# EAGLE design Smart ezNODE 503 M1 (EAGLE 7.7.0)
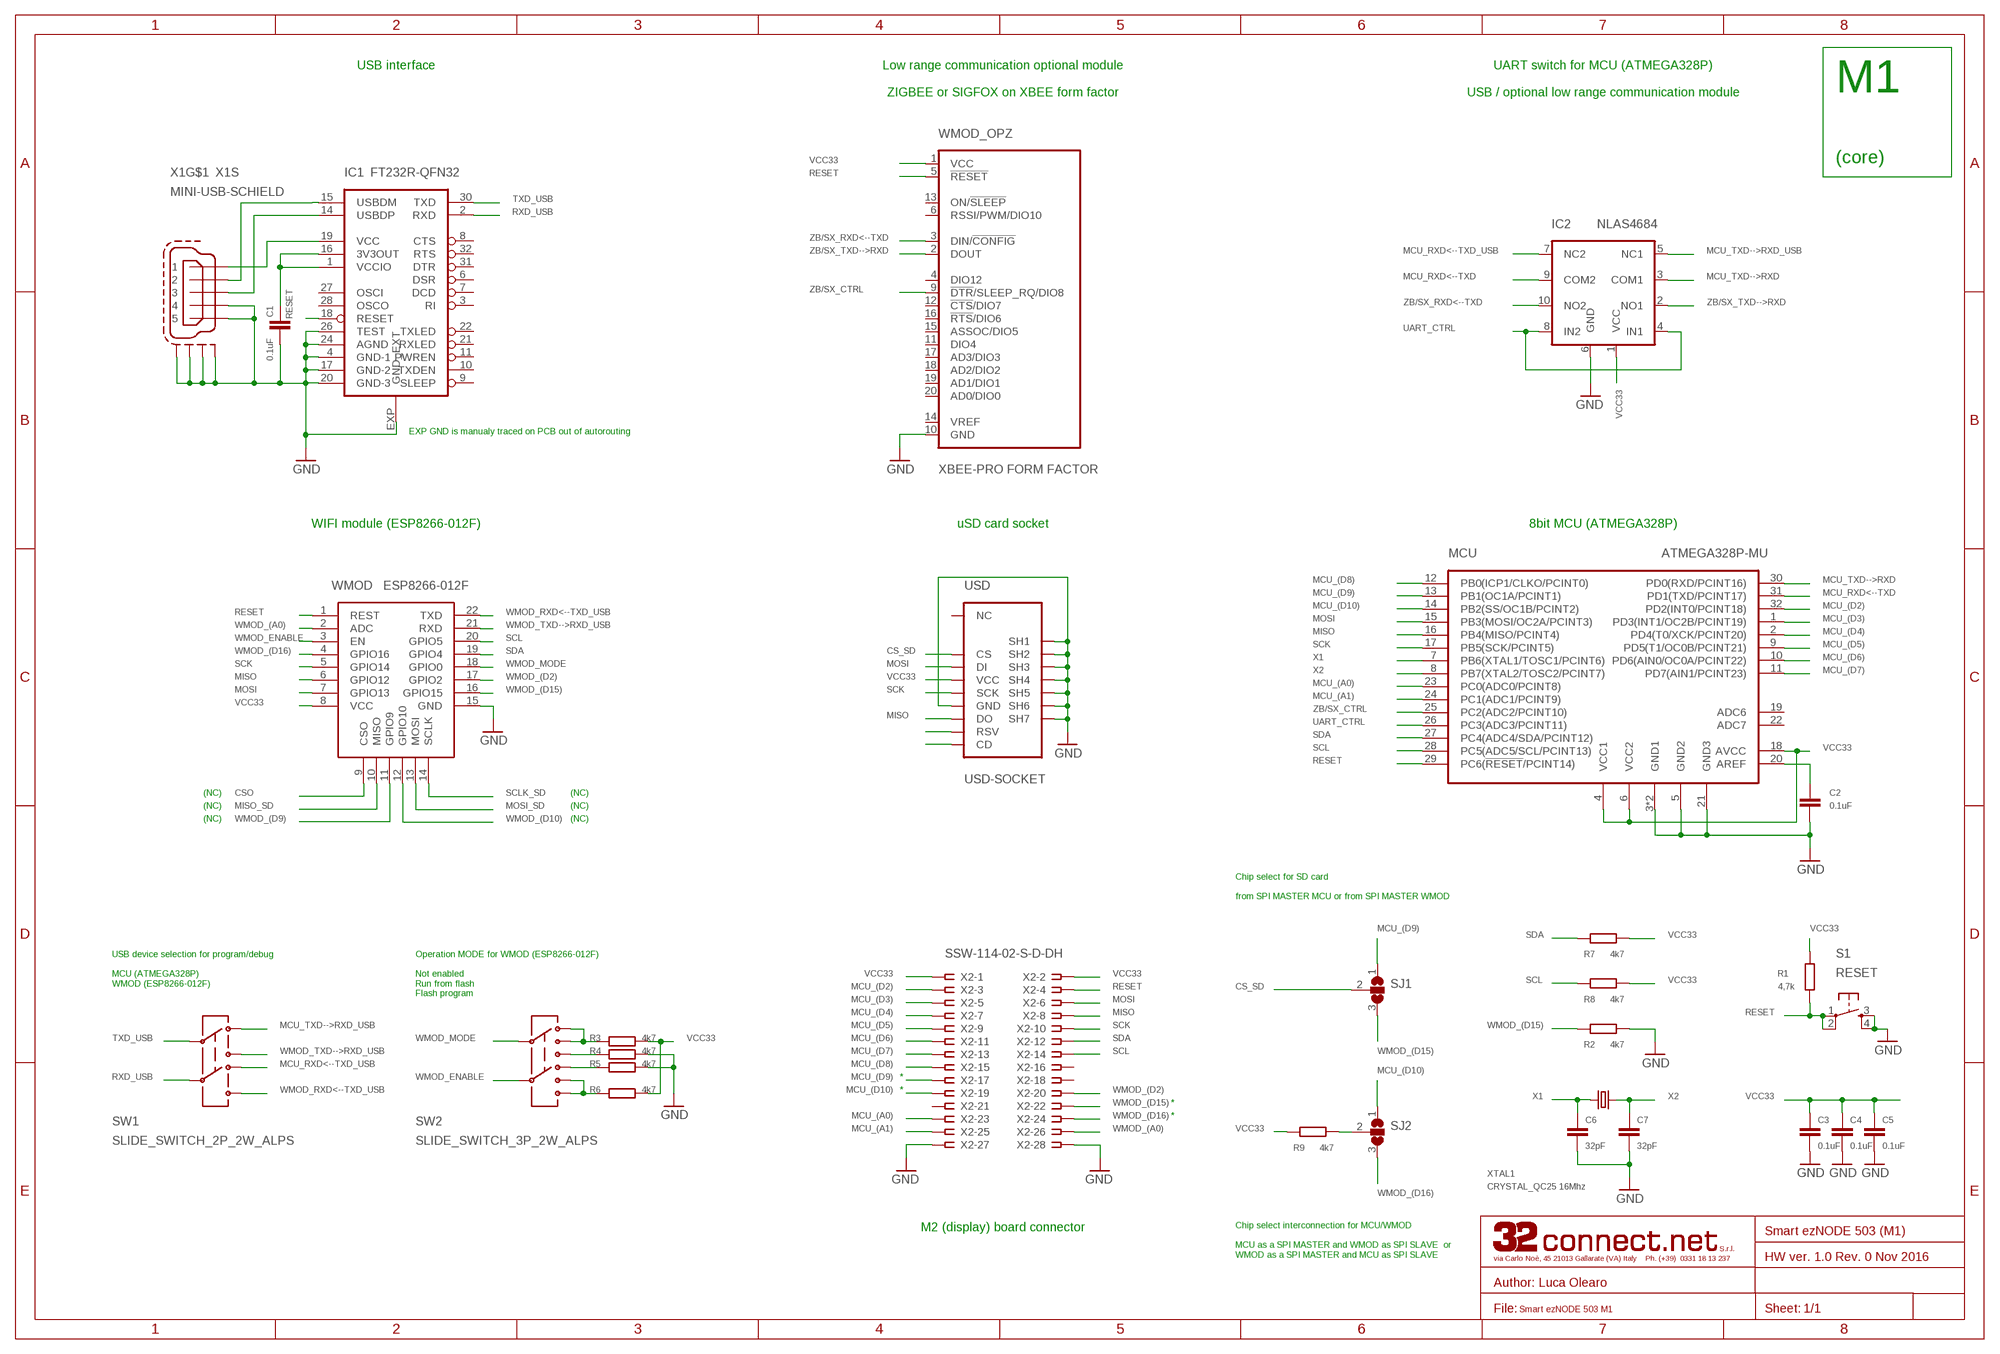
[diagram p0: schematic, sheet 1]

## Parts
C1  0.1uF  C-EUC0402  [C0402]
C2  0.1uF  C-EUC0402  [C0402]
C3  0.1uF  C-EUC0402  [C0402]
C4  0.1uF  C-EUC0402  [C0402]
C5  0.1uF  C-EUC0402  [C0402]
C6  32pF  C-EUC0201  [C0201]
C7  32pF  C-EUC0201  [C0201]
IC1  FT232R-QFN32  [QFN32]
IC2  NLAS4684  NLAS4684MSOP10  [MSOP10]
MCU  ATMEGA328P-MU  ATMEGA48/88/168/328_REDUCED-MU  [MLF32]
R1  4,7k  R-EU_R0402  [R0402]
R2  4k7  R-EU_R0402  [R0402]
R3  4k7  R-EU_R0402  [R0402]
R4  4k7  R-EU_R0402  [R0402]
R5  4k7  R-EU_R0402  [R0402]
R6  4k7  R-EU_R0402  [R0402]
R7  4k7  R-EU_R0402  [R0402]
R8  4k7  R-EU_R0402  [R0402]
R9  4k7  R-EU_R0402  [R0402]
S1  RESET  TAC_SWITCH4  [C&K_KMS]
SJ1  SJ2W  [SJ_2]
SJ2  SJ2W  [SJ_2]
SW1  SLIDE_SWITCH_2P_2W_ALPS  SLIDE_SWITCH_2P_2W_ALPS_SSSS820201  [SLIDE_SWITCH_ALPS_SSSS820201]
SW2  SLIDE_SWITCH_3P_2W_ALPS  SLIDE_SWITCH_3P_2W_ALPS_SSSS820301  [SLIDE_SWITCH_ALPS_SSSS820301]
USD  USD-SOCKET  [USD-SOCKET-PP]
WMOD  ESP8266-012F  ESP8266-12GPIO04/05_CORRECTED  [ESP8266-ESP12]
WMOD_OPZ  XBEE-PRO FORM FACTOR  XBEE-PRO  [XBEE-PRO]
X1  MINI-USB-SCHIELD  MINI-USB-SCHIELD--  [MOLEX_67503-X20]
X2  SSW-114-02-S-D-DH  [FTE-114-XX-G-DH]
XTAL1  CRYSTAL_QC25 16Mhz  CRYSTAL_QC25  [CRYSTAL_QC25]

## Nets
CS_SD: SJ1.2 USD.P$2(CS)
CSO: WMOD.9(CSO)
D+: IC1.14(USBDP) X1.3
D-: IC1.15(USBDM) X1.2
GND: C1.2 C2.2 C3.2 C4.2 C5.2 C6.2 C7.2 IC1.4(GND-1) IC1.17(GND-2) IC1.20(GND-3) IC1.24(AGND) IC1.26(TEST) IC1.EXP(GND_EXT) IC2.6(GND) MCU.3(GND1) MCU.5(GND2) MCU.21(GND3) MCU.TH(GND1) R2.2 R4.1 R5.1 S1.3 S1.4 USD.P$6(GND) USD.P$9(SH1) USD.P$10(SH2) USD.P$12(SH3) USD.P$13(SH4) USD.P$14(SH5) USD.P$15(SH6) USD.P$16(SH7) WMOD.15(GND) WMOD_OPZ.10(GND) X1.4 X1.5 X1.M1(S:S1) X1.M2(S:S2) X1.M3(S:S3) X1.M4(S:S4) X2.27 X2.28
MCU_(A0): MCU.23(PC0(ADC0/PCINT8)) X2.23
MCU_(A1): MCU.24(PC1(ADC1/PCINT9)) X2.25
MCU_(D2): MCU.32(PD2(INT0/PCINT18)) X2.3
MCU_(D3): MCU.1(PD3(INT1/OC2B/PCINT19)) X2.5
MCU_(D4): MCU.2(PD4(T0/XCK/PCINT20)) X2.7
MCU_(D5): MCU.9(PD5(T1/OC0B/PCINT21)) X2.9
MCU_(D6): MCU.10(PD6(AIN0/OC0A/PCINT22)) X2.11
MCU_(D7): MCU.11(PD7(AIN1/PCINT23)) X2.13
MCU_(D8): MCU.12(PB0(ICP1/CLKO/PCINT0)) X2.15
MCU_(D9): MCU.13(PB1(OC1A/PCINT1)) SJ1.1 X2.17
MCU_(D10): MCU.14(PB2(SS/OC1B/PCINT2)) SJ2.1 X2.19
MCU_RXD<--TXD: IC2.9(COM2) MCU.31(PD1(TXD/PCINT17))
MCU_RXD<--TXD_USB: IC2.7(NC2) SW1.4
MCU_TXD-->RXD: IC2.3(COM1) MCU.30(PD0(RXD/PCINT16))
MCU_TXD-->RXD_USB: IC2.5(NC1) SW1.1
MISO: MCU.16(PB4(MISO/PCINT4)) USD.P$7(DO) WMOD.6(GPIO12) X2.8
MISO_SD: WMOD.10(MISO)
MOSI: MCU.15(PB3(MOSI/OC2A/PCINT3)) USD.P$3(DI) WMOD.7(GPIO13) X2.6
MOSI_SD: WMOD.13(MOSI)
N$1: R9.2 SJ2.2
N$6: C1.1 IC1.1(VCCIO) IC1.16(3V3OUT)
N$9: R6.2 SW2.6 SW2.8
N$11: C2.1 MCU.20(AREF)
N$12: R3.2 SW2.1 SW2.2
N$14: R4.2 SW2.4
N$15: R5.2 SW2.5
N$18: USD.P$8(RSV)
N$19: USD.P$11(CD)
RESET: IC1.18(RESET) MCU.29(PC6(!RESET!/PCINT14)) R1.1 S1.1 S1.2 WMOD.1(REST) WMOD_OPZ.5(!RESET) X2.4
RXD_USB: IC1.2(RXD) SW1.5
SCK: MCU.17(PB5(SCK/PCINT5)) USD.P$5(SCK) WMOD.5(GPIO14) X2.10
SCL: MCU.28(PC5(ADC5/SCL/PCINT13)) R8.1 WMOD.20(GPIO5) X2.14
SCLK_SD: WMOD.14(SCLK)
SDA: MCU.27(PC4(ADC4/SDA/PCINT12)) R7.1 WMOD.19(GPIO4) X2.12
TXD_USB: IC1.30(TXD) SW1.2
UART_CTRL: IC2.4(IN1) IC2.8(IN2) MCU.26(PC3(ADC3/PCINT11))
VBUS: IC1.19(VCC) X1.1
VCC33 [VCC1]: C3.1 C4.1 C5.1 IC2.1(VCC) MCU.4(VCC1) MCU.6(VCC2) MCU.18(AVCC) R1.2 R3.1 R6.1 R7.2 R8.2 R9.1 USD.P$4(VCC) WMOD.8(VCC) WMOD_OPZ.1(VCC) X2.1 X2.2
WMOD_(A0): WMOD.2(ADC) X2.26
WMOD_(D2): WMOD.17(GPIO2) X2.20
WMOD_(D9): WMOD.11(GPIO9)
WMOD_(D10): WMOD.12(GPIO10)
WMOD_(D15): R2.1 SJ1.3 WMOD.16(GPIO15) X2.22
WMOD_(D16): SJ2.3 WMOD.4(GPIO16) X2.24
WMOD_ENABLE: SW2.7 WMOD.3(EN)
WMOD_MODE: SW2.3 WMOD.18(GPIO0)
WMOD_RXD<--TXD_USB: SW1.6 WMOD.22(TXD)
WMOD_TXD-->RXD_USB: SW1.3 WMOD.21(RXD)
X1: C6.1 MCU.7(PB6(XTAL1/TOSC1/PCINT6)) XTAL1.P$1
X2: C7.1 MCU.8(PB7(XTAL2/TOSC2/PCINT7)) XTAL1.P$3
ZB/SX_CTRL: MCU.25(PC2(ADC2/PCINT10)) WMOD_OPZ.9(!DTR!/SLEEP_RQ/DIO8)
ZB/SX_RXD<--TXD: IC2.10(NO2) WMOD_OPZ.3(DIN/!CONFIG)
ZB/SX_TXD-->RXD: IC2.2(NO1) WMOD_OPZ.2(DOUT)
Unconnected: IC1.3(RI) IC1.6(DSR) IC1.7(DCD) IC1.8(CTS) IC1.9(SLEEP) IC1.10(TXDEN) IC1.11(PWREN) IC1.21(RXLED) IC1.22(TXLED) IC1.27(OSCI) IC1.28(OSCO) IC1.31(DTR) IC1.32(RTS) MCU.19(ADC6) MCU.22(ADC7) USD.P$1(NC) WMOD_OPZ.4(DIO12) WMOD_OPZ.6(RSSI/PWM/DIO10) WMOD_OPZ.11(DIO4) WMOD_OPZ.12(!CTS!/DIO7) WMOD_OPZ.13(ON/!SLEEP) WMOD_OPZ.14(VREF) WMOD_OPZ.15(ASSOC/DIO5) WMOD_OPZ.16(!RTS!/DIO6) WMOD_OPZ.17(AD3/DIO3) WMOD_OPZ.18(AD2/DIO2) WMOD_OPZ.19(AD1/DIO1) WMOD_OPZ.20(AD0/DIO0) X2.16 X2.18 X2.21 XTAL1.P$2 XTAL1.P$4

## Notes on the sheet
- USB interface
- Low range communication optional module
  
  ZIGBEE or SIGFOX on XBEE form factor
- UART switch for MCU (ATMEGA328P)
  
  USB / optional low range communication module
- M1
- (core)
- EXP GND is manualy traced on PCB out of autorouting
- WIFI module (ESP8266-012F) | uSD card socket | 8bit MCU (ATMEGA328P)
- (NC) | (NC)
- (NC) | (NC)
- (NC) | (NC)
- Chip select for SD card
  
  from SPI MASTER MCU or from SPI MASTER WMOD
- USB device selection for program/debug
  
  MCU (ATMEGA328P)
  WMOD (ESP8266-012F)
- Operation MODE for WMOD (ESP8266-012F)
  
  Not enabled
  Run from flash
  Flash program
- *
- *
- *
- *
- M2 (display) board connector
- Chip select interconnection for MCU/WMOD
  
  MCU as a SPI MASTER and WMOD as SPI SLAVE  or 
  WMOD as a SPI MASTER and MCU as SPI SLAVE
- Smart ezNODE 503 (M1)
- HW ver. 1.0 Rev. 0 Nov 2016

## Library data of the parts
C1-C7 = rcl:C-EU: CAPACITOR, European symbol
IC1 = Multiconnect_base:FT232R: USB UART FT232RL 4th Generation USB UART (USB <-> Serial) Controller. Spark Fun Electronics SKU : COM-00650 Production SKU IC-00870
IC2 = Multiconnect_base:NLAS4684
MCU = Multiconnect_base:ATMEGA48/88/168/328_REDUCED
R1-R9 = rcl:R-EU_: RESISTOR, European symbol
S1 = Multiconnect_base:TAC_SWITCH: Momentary Switch
SJ1 SJ2 = Multiconnect_base:SJ2W: SMD solder JUMPER
SW1 = Multiconnect_base:SLIDE_SWITCH_2P_2W_ALPS_SSSS820201: Side Switch 2 Position 2 Way ALPS SSSS820201
SW2 = Multiconnect_base:SLIDE_SWITCH_3P_2W_ALPS_SSSS820301: Side Switch 3 Position 2 Way ALPS SSSS820301
USD = Multiconnect_base:USD-SOCKET: MICRO SD SOCKET
WMOD = ESP8266 EAGLE LIBRARY:ESP8266-12: Espressif ESP8266 ESP-12 Module with GPIO04 and GPIO05 corrected.
WMOD_OPZ = Multiconnect_base:XBEE: XBee (TM) /XBee-PRO(TM) OEM RF Modules Source: MaxStream, Inc. xbee_productmanual.pdf; MPN: XBP24-AWI-001; OC_FARNELL: 1337916; OC_NEWARK: 42M2667
X1 = con-cypressindustries:MINI-USB-SCHIELD-: MINI USB-B Conector Source: www.cypressindustries.com
X2 = con-samtec:SSW-114-02-S-D: THROUGH-HOLE .025" SQ POST SOCKET Source: Samtec SSW.pdf
XTAL1 = Multiconnect_base:CRYSTAL_QC25

## Net classes
0 default: width 0.152 mm, clearance 0.152 mm
1 VCC1: width 0.203 mm, clearance 0.152 mm

## Board
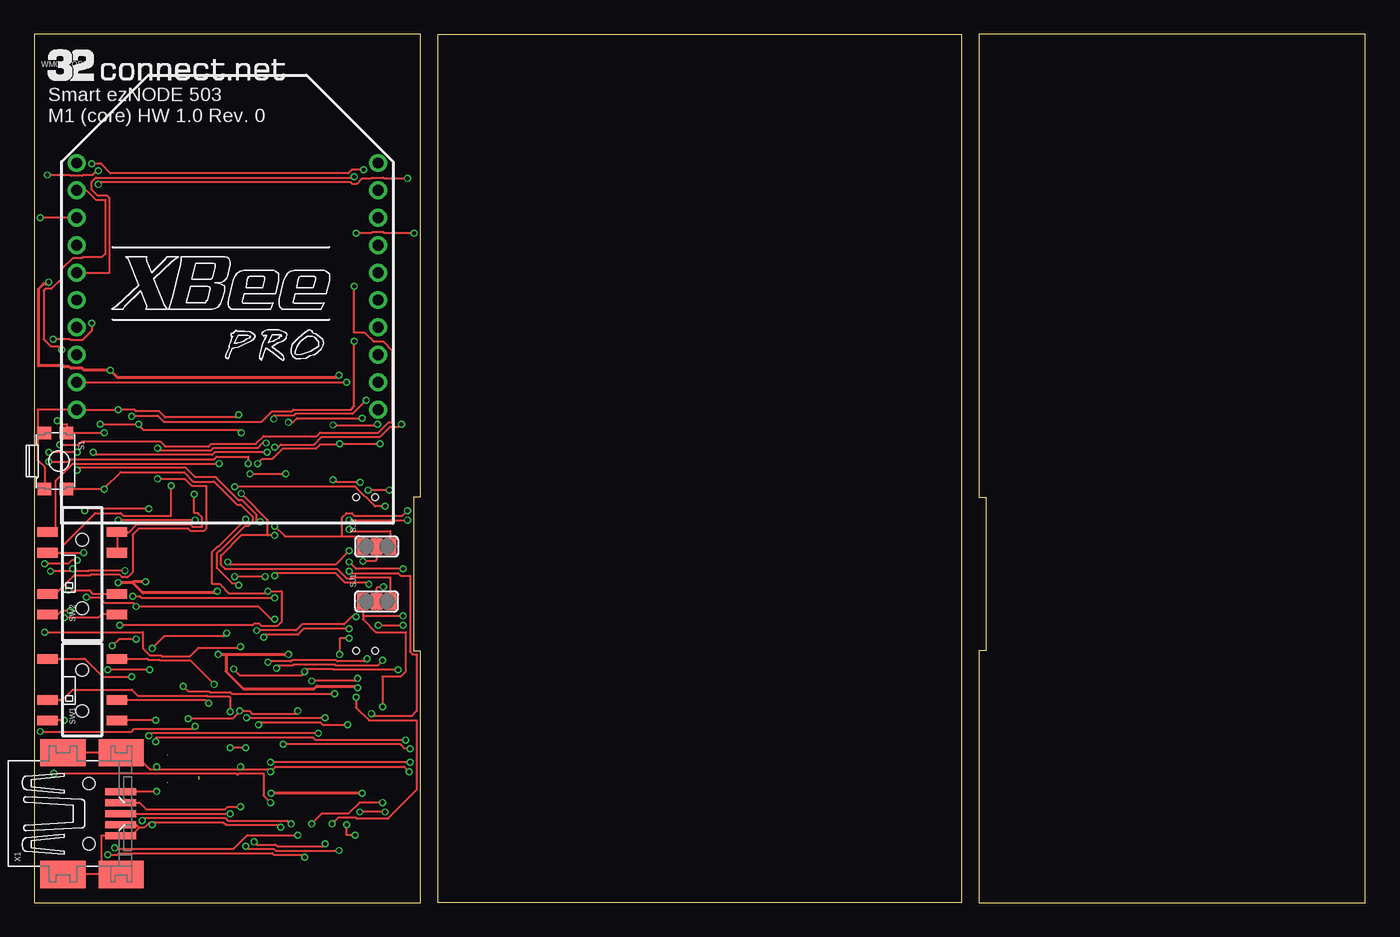
[diagram p1: board, top side]
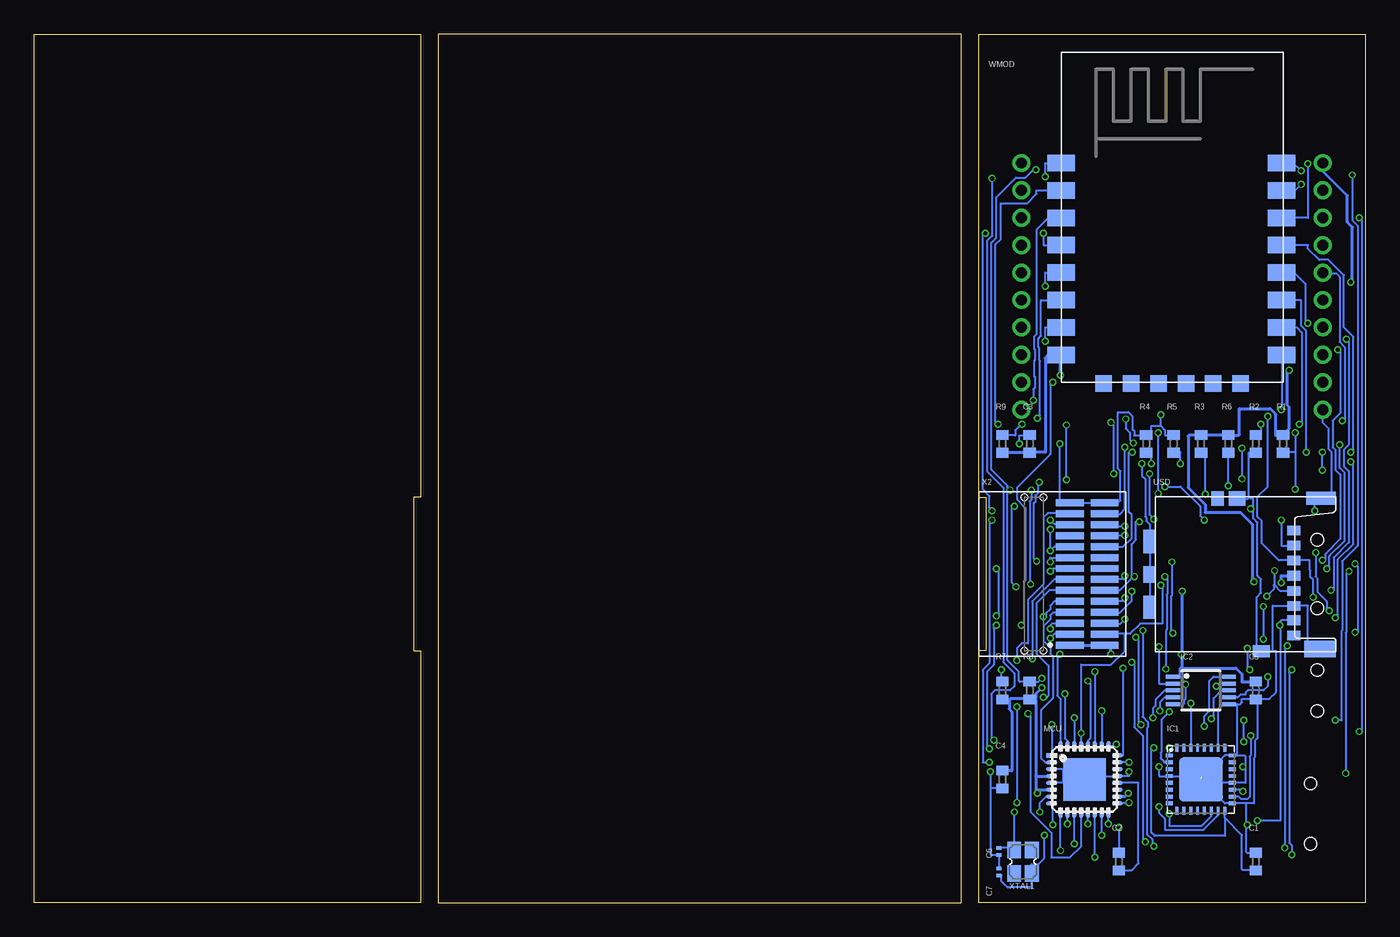
[diagram p2: board, bottom side, seen from below]

Size 97.2 x 63.4 mm. Coordinates in mm from the lower left corner, seen from the top.
Outline: 28.2,0 28.2,18.4 27.7,18.4 27.7,29.6 28.2,29.6 28.2,63.4 0,63.4 0,0 28.2,0
Outline: 67.7,0 29.5,0 29.5,63.4 67.7,63.4 67.7,0
Outline: 97.2,0 97.2,63.4 69,63.4 69,29.6 69.5,29.6 69.5,18.4 69,18.4 69,0 97.2,0
Copper layers (1*16): Top 0.035mm / dielectric 1.5mm / Bottom 0.035mm
Design rules "default *": minimum track width 6mil, minimum drill 12mil, track to track 6mil, track to pad 8mil, pad to pad 6mil, via to via 6mil, smd to smd 6mil, copper to edge 6mil, drill to drill 8mil, minimum pad ring 10mil, minimum via ring 4mil, stop-mask expansion 4mil, vias tented up to drill 0mil, thermal gap 10mil
Holes 0.5 mm at 24.9,18.4 24.9,29.6 23.5,29.6 23.5,18.4
tKeepout: area 0,62.2 to 13.2,63.4; area 0,0 to 13.2,1.2; area 29.5,0 to 67.7,1.2; area 29.5,62.2 to 67.7,63.4; area 84,62.2 to 97.2,63.4; area 84,0 to 97.2,1.2; area 0,62.2 to 13.2,63.4; area 0,0 to 13.2,1.2; area 29.5,0 to 67.7,1.2; area 29.5,62.2 to 67.7,63.4; area 84,62.2 to 97.2,63.4; area 84,0 to 97.2,1.2
bKeepout: area 0,62.2 to 13.2,63.4; area 0,0 to 13.2,1.2; area 29.5,0 to 67.7,1.2; area 29.5,62.2 to 67.7,63.4; area 84,62.2 to 97.2,63.4; area 84,0 to 97.2,1.2; area 0,62.2 to 13.2,63.4; area 0,0 to 13.2,1.2; area 29.5,0 to 67.7,1.2; area 29.5,62.2 to 67.7,63.4; area 84,62.2 to 97.2,63.4; area 84,0 to 97.2,1.2
tRestrict: area 0.1,54.7 to 28.1,63.3
bRestrict: area 0.1,54.7 to 28.1,63.3

### Footprints (pad centres in the part's own frame; a part is rotated, then mirrored left to right if it is on the bottom)
C0402 = smd 0.7 x 0.9: 1 -0.65,0; 2 0.65,0
C0201 = smd 0.25 x 0.35: 1 -0.25,0; 2 0.25,0
QFN32 = smd 0.6 x 0.3: 1 -2.3,1.75; 2 -2.3,1.25; 3 -2.3,0.75; 4 -2.3,0.25; 5 -2.3,-0.25; 6 -2.3,-0.75; 7 -2.3,-1.25; 8 -2.3,-1.75; 17 2.3,-1.75; 18 2.3,-1.25; 19 2.3,-0.75; 20 2.3,-0.25; 21 2.3,0.25; 22 2.3,0.75; 23 2.3,1.25; 24 2.3,1.75 | smd 0.3 x 0.6: 9 -1.75,-2.3; 10 -1.25,-2.3; 11 -0.75,-2.3; 12 -0.25,-2.3; 13 0.25,-2.3; 14 0.75,-2.3; 15 1.25,-2.3; 16 1.75,-2.3; 25 1.75,2.3; 26 1.25,2.3; 27 0.75,2.3; 28 0.25,2.3; 29 -0.25,2.3; 30 -0.75,2.3; 31 -1.25,2.3; 32 -1.75,2.3 | smd 3.2 x 3.2: EXP 0,0
MSOP10 = smd 1 x 0.3: 1 -2.05,1; 2 -2.05,0.5; 3 -2.05,0; 4 -2.05,-0.5; 5 -2.05,-1; 6 2.05,-1; 7 2.05,-0.5; 8 2.05,0; 9 2.05,0.5; 10 2.05,1
MLF32 = smd 0.8 x 0.3: 1 -2.4,1.75; 2 -2.4,1.25; 3 -2.4,0.75; 4 -2.4,0.25; 5 -2.4,-0.25; 6 -2.4,-0.75; 7 -2.4,-1.25; 8 -2.4,-1.75; 17 2.4,-1.75; 18 2.4,-1.25; 19 2.4,-0.75; 20 2.4,-0.25; 21 2.4,0.25; 22 2.4,0.75; 23 2.4,1.25; 24 2.4,1.75 | smd 0.3 x 0.8: 9 -1.75,-2.4; 10 -1.25,-2.4; 11 -0.75,-2.4; 12 -0.25,-2.4; 13 0.25,-2.4; 14 0.75,-2.4; 15 1.25,-2.4; 16 1.75,-2.4; 25 1.75,2.4; 26 1.25,2.4; 27 0.75,2.4; 28 0.25,2.4; 29 -0.25,2.4; 30 -0.75,2.4; 31 -1.25,2.4; 32 -1.75,2.4 | smd 3.1 x 3.1: TH 0,0
R0402 = smd 0.7 x 0.9: 1 -0.65,0; 2 0.65,0
C&K_KMS = smd 0.9 x 1: 1 0.45,2.1; 2 4.55,2.1; 3 0.45,0.5; 4 4.55,0.5
SJ_2 = smd 0.8 x 1.2: 1 -1.024,0; 2 0,0; 3 1.024,0
SLIDE_SWITCH_ALPS_SSSS820201 = smd 0.7 x 1.5: 1 -2.3,2.525; 2 0.7,2.525; 3 2.2,2.525; 4 -2.3,-2.525; 5 0.7,-2.525; 6 2.2,-2.525 | hole 0.9: -1.5,0; 1.5,0
SLIDE_SWITCH_ALPS_SSSS820301 = smd 0.7 x 1.5: 1 -3.05,2.525; 2 -1.55,2.525; 3 1.45,2.525; 4 2.95,2.525; 5 -3.05,-2.525; 6 -1.55,-2.525; 7 1.45,-2.525; 8 2.95,-2.525 | hole 0.9: -2.5,0; 2.5,0
USD-SOCKET-PP = smd 0.7 x 0.95: P$1 -3.17,4.29; P$2 -2.07,4.29; P$3 -0.97,4.29; P$4 0.13,4.29; P$5 1.23,4.29; P$6 2.33,4.29; P$7 3.38,4.29; P$8 4.48,4.29 | smd 0.95 x 2.17: P$9 -5.54,6.26 | smd 1.05 x 1.2: P$10 -5.5,0.13 | smd 1.05 x 0.9: P$11 -5.5,-1.28 | smd 1.7 x 0.88: P$12 -2.37,-6.27; P$14 2.43,-6.27 | smd 1.2 x 0.88: P$13 0.03,-6.27 | smd 1.19 x 2.3: P$15 5.48,6.19 | smd 0.88 x 1.25: P$16 5.64,1.92
ESP8266-ESP12 = smd 2 x 1.2: 1 0,16; 2 0,14; 3 0,12; 4 0,10; 5 0,8; 6 0,6; 7 0,4; 8 0,2; 15 16.1,2; 16 16.1,4; 17 16.1,6; 18 16.1,8; 19 16.1,10; 20 16.1,12; 21 16.1,14; 22 16.1,16 | smd 1.2 x 1.2: 9 3.1,-0.1; 10 5.1,-0.1; 11 7.1,-0.1; 12 9.1,-0.1; 13 11.1,-0.1; 14 13.1,-0.1
XBEE-PRO = drill 0.8 pad 1.27: 1 -11,9; 2 -11,7; 3 -11,5; 4 -11,3; 5 -11,1; 6 -11,-1; 7 -11,-3; 8 -11,-5; 9 -11,-7; 10 -11,-9; 11 11,-9; 12 11,-7; 13 11,-5; 14 11,-3; 15 11,-1; 16 11,1; 17 11,3; 18 11,5; 19 11,7; 20 11,9
MOLEX_67503-X20 = smd 2.25 x 0.5: 1 2.325,1.6; 2 2.325,0.8; 3 2.325,0; 4 2.325,-0.8; 5 2.325,-1.6 | smd 3.3 x 2: M1 -1.9,-4.45; M2 -1.9,4.45; M3 2.35,4.45; M4 2.35,-4.45 | hole 0.9: 0,2.2; 0,-2.2
FTE-114-XX-G-DH = smd 0.508 x 2.032: 1 -5.2,1.27; 2 -5.2,-1.27; 3 -4.4,1.27; 4 -4.4,-1.27; 5 -3.6,1.27; 6 -3.6,-1.27; 7 -2.8,1.27; 8 -2.8,-1.27; 9 -2,1.27; 10 -2,-1.27; 11 -1.2,1.27; 12 -1.2,-1.27; 13 -0.4,1.27; 14 -0.4,-1.27; 15 0.4,1.27; 16 0.4,-1.27; 17 1.2,1.27; 18 1.2,-1.27; 19 2,1.27; 20 2,-1.27; 21 2.8,1.27; 22 2.8,-1.27; 23 3.6,1.27; 24 3.6,-1.27; 25 4.4,1.27; 26 4.4,-1.27; 27 5.2,1.27; 28 5.2,-1.27
CRYSTAL_QC25 = smd 1.2 x 1: P$1 -0.85,-0.65; P$2 0.85,-0.65; P$3 0.85,0.65; P$4 -0.85,0.65

### Placement (x,y rotation side)
C1  8,3 90 bottom
C2  18,3 90 bottom
C3  24.5,33.5 90 bottom
C4  26.5,9 270 bottom
C5  8,15.5 270 bottom
C6  26.75,3.75 270 bottom
C7  26.75,2.25 90 bottom
IC1  12,9 0 bottom
IC2  12,15.5 0 bottom
MCU  20.5,9 0 bottom
R1  6,33.5 90 bottom
R2  8,33.5 270 bottom
R3  12,33.5 270 bottom
R4  16,33.5 270 bottom
R5  14,33.5 270 bottom
R6  10,33.5 270 bottom
R7  26.5,15.5 270 bottom
R8  24.5,15.5 270 bottom
R9  26.5,33.5 90 bottom
S1  0.25,34.75 270 top
SJ1  25,22 0 top
SJ2  25,26 180 top
SW1  3.5,15.5 270 top
SW2  3.5,24 270 top
USD  9.5,24 270 bottom
WMOD  22.2,38 0 bottom
WMOD_OPZ  14.1,45 0 top
X1  4,6.5 0 top
X2  20.3,24 90 bottom
XTAL1  25,3 270 bottom

### Tracks (layer width: path | path; a pad name or v marks a point on that pad's centre or on a via)
CS_SD  (via drill 0.3)
  Top 0.152: v11.75,27.94 v6.12,27.94 | v14.62,30.38 23.44,30.38 24.88,28.94 v25.62,28.94 | v25.5,23.06 25.12,23.06 25,22.94 SJ1.2
  Bottom 0.152: v6.12,27.94 6.12,26.06 5.25,26.06 USD.P$2 | v11.75,27.94 12.06,28.25 12.06,28.94 13.5,30.38 v14.62,30.38 | v25.62,28.94 25.81,28.94 25.81,23.38 v25.5,23.06
D+  (via drill 0.3)
  Top 0.152: X1.3 v14.31,6.5
  Bottom 0.152: IC1.14 11.25,6.31 11.94,5.62 14.31,5.62 v14.31,6.5
D-  (via drill 0.3)
  Top 0.152: v15.06,7 14.12,7 13.94,6.81 8.19,6.81 7.69,7.31 6.38,7.31 X1.2
  Bottom 0.152: IC1.15 10.75,6.38 11.81,5.31 14.62,5.31 14.62,6.12 15.06,6.56 v15.06,7
GND  (via drill 0.3)  (3 unrouted)
  Top 0.152: S1.4 0.75,31.81 0.25,32.31 0.25,34.31 | 0.25,34.31 0.75,34.31 S1.3 | 0.25,34.31 0.25,36 WMOD_OPZ.10 v6.12,36 7.31,36 7.44,35.88 9.12,35.88 9.56,35.44 14.75,35.44 v14.94,35.62 | v25.25,33.5 v22.31,33.5 22.31,33.44 20.88,33.44 20.56,33.12 18.12,33.12 17.38,32.38 16.62,32.38 v16.31,32.06 | 8.94,9.75 8.44,9.75 7.25,10.94 6.38,10.94 X1.M3 6.31,10.94 2.12,10.94 X1.M2 | 8.94,9.75 15.06,9.75 v15.06,9.94 15.12,9.75 17.25,9.75 | v27.38,9.56 27,9.94 17.62,9.94 17.44,9.75 17.25,9.75 | 17.25,9.75 v17.25,9.56 | X1.M1 2.12,2.06 6.31,2.06 X1.M4 4.88,2.12 4.88,4.88 6.31,4.88 X1.5 6.38,4.88 7.06,4.88 7.62,5.44 7.62,5.5 | v18,5.5 18,5.69 14,5.69 13.81,5.88 8.44,5.88 8.28,5.72 | 8.28,5.72 8.06,5.5 7.62,5.5 | 7.62,5.5 7.44,5.69 6.38,5.69 X1.4 | v8.62,5.69 8.31,5.69 8.28,5.72 | v8.94,9.94 8.94,9.75 | v3.69,28.62 3.81,28.75 v8.38,28.75
  Bottom 0.152: v6.12,36 6.06,36.06 6.06,40 WMOD.15 | WMOD_OPZ.10 3.12,36 3.12,35.06 2.69,34.62 2.69,33.12 2.5,32.94 2.5,29.56 3.19,29.56 USD.P$9 3.31,29.56 3.69,29.56 v3.69,28.62 | 14.94,34.81 14.62,34.5 14.62,34.12 14,34.12 R5.1 | 14.94,34.81 15.62,34.81 15.62,34.19 15.69,34.12 16,34.12 R4.1 16.06,34.12 16.88,34.12 16.88,34.44 17,34.56 17,35.5 17.31,35.81 18.06,35.81 18.06,31.69 17.88,31.5 17.88,29.38 18.06,29.19 19,29.19 X2.28 19.06,29.19 21.5,29.19 X2.27 21.62,29.19 22.25,29.19 22.31,29.25 v22.31,33.5 | USD.P$14 15.75,21.62 15.75,23.94 USD.P$13 15.75,24 15.75,26.31 USD.P$12 15.75,26.44 15.75,27.62 16,27.88 16,28.12 16.06,28.19 16.06,30.94 16.31,31.19 v16.31,32.06 | v25.25,33.5 25.25,34.12 24.5,34.12 C3.2 | 14.94,34.81 v14.94,35.62 | 22.06,8.75 21.31,8.75 21.31,8.94 21.25,9 MCU.TH 19.75,9 19.69,9.06 19.69,9.25 MCU.21 17.25,9.25 v17.25,9.56 | 22.06,8.75 MCU.5 | MCU.3 22.06,9.75 22.06,8.75 | C7.2 C6.2 27.38,3.5 27.38,8.31 | 27.38,8.31 27.31,8.38 26.5,8.38 C4.2 | v15.06,9.94 15.06,9.25 IC1.4 12,9.25 | v27.38,9.56 27.38,8.31 | v18,5.5 C2.2 | USD.P$15 3.31,18.5 4.12,18.5 4.19,18.56 4.19,21.69 5.19,21.69 USD.P$6 5.25,21.69 6.75,21.69 6.75,18.38 | 8.5,29.56 8.5,32.88 8,32.88 R2.2 | 8.5,29.56 8.56,29.5 USD.P$10 | 8.69,7.25 9.69,7.25 | 9.69,7.25 IC1.17 | 8.69,5.69 8.69,3.69 8.62,3.62 8,3.62 C1.2 | 8.69,5.69 8.69,7.25 | IC1.20 8.75,8.75 8.75,9.94 | 8.75,9.94 8.75,10.69 8.81,10.75 9.38,10.75 | IC1.24 9.38,10.75 | IC1.26 10.75,14.12 10.38,14.5 IC2.6 9.38,14.5 | 9.38,14.5 9.12,14.5 9,14.62 9,14.88 8,14.88 C5.2 | 6.75,18.38 6.5,18.38 6.5,15.38 7,14.88 7.94,14.88 C5.2 | 6.75,18.38 7.56,18.38 USD.P$16 7.62,18.38 7.88,18.38 7.94,18.44 7.94,22.31 7.62,22.62 7.62,23.62 7.88,23.88 7.88,27.75 8.19,28.06 8.19,28.75
  Bottom 0.152: 9.38,14.5 9.38,10.75 | 8.69,7.25 8.12,7.25 8.12,10.56 8.06,10.62 8.06,11.81 7.88,12 7.88,14.81 C5.2 | 8.19,28.75 8.19,29.5 8.38,29.5 8.44,29.56 8.5,29.56 | v8.62,5.69 8.69,5.69 | 8.75,9.94 v8.94,9.94 | 8.19,28.75 v8.38,28.75 | 9.75,10.75 10.25,10.75 10.56,10.44 | 9.75,8.75 10.44,8.75 | 9.69,7.25 10.25,7.25 10.56,7.56
  Bottom 0.406: 12.25,9.25 IC1.EXP
MCU_(A0)  (via drill 0.3)
  Top 0.152: v27.44,10.25 v17.25,10.25 | v23,27.94 v27.25,27.94
  Bottom 0.152: v17.25,10.25 MCU.23 | v27.44,10.25 27.94,10.25 27.94,17 27.44,17.5 27.44,27.75 v27.25,27.94 | v23,27.94 22.69,27.62 21.62,27.62 X2.23
MCU_(A1)  (via drill 0.3)
  Top 0.152: v17.69,17.12 17.69,17.31 18.88,17.31 18.94,17.38 21.94,17.38 22,17.31 25.06,17.31 v25.44,17.69
  Bottom 0.152: MCU.24 17.69,10.75 v17.69,17.12 | v25.44,17.69 25.44,18.56 25.06,18.94 24.62,18.94 24.62,22.12 23.5,23.25 23.5,28.12 23.19,28.44 22.31,28.44 22.25,28.38 21.62,28.38 X2.25
MCU_(D2)  (via drill 0.3)
  Top 0.152: v22.31,18.12 22.31,19.31 v23,19.31
  Bottom 0.152: MCU.32 22.25,14.88 22.5,15.12 22.5,17.94 v22.31,18.12 | v23,19.31 22.69,19.62 21.62,19.62 X2.3
MCU_(D3)  (via drill 0.3)
  Top 0.152: v22.88,13 21.06,13 20.88,13.19 16.56,13.19 v16.38,13 | v16.75,19.38 16.75,19.56 19.25,19.56 19.69,20 v23,20
  Bottom 0.152: v22.88,13 22.88,10.75 MCU.1 | v16.38,13 16.56,13 16.56,19.19 v16.75,19.38 | v23,20 23,20.25 22.88,20.38 21.62,20.38 X2.5
MCU_(D4)
  Bottom 0.152: MCU.2 23.38,10.25 23.69,10.56 23.69,14.06 22.81,14.94 22.81,18 23,18.19 23,18.62 23.5,19.12 23.5,20.19 23,20.69 23,21 22.81,21.19 21.62,21.19 X2.7
MCU_(D5)  (via drill 0.3)
  Top 0.152: v22.25,3.81 17.62,3.81 17.5,3.94 15.62,3.94 v15.44,4.12 | v16.25,19.88 19.12,19.88 19.56,20.31 22.62,20.31 23.19,20.88 v23.5,20.88
  Bottom 0.152: v22.25,3.81 MCU.9 | v15.44,4.12 15.56,4.25 15.56,4.62 15.94,5 15.94,12.75 15.88,12.81 15.88,13.19 16.25,13.56 v16.25,19.88 | v23.5,20.88 23.31,20.88 23.31,21.12 23,21.44 23,21.69 22.69,22 X2.9
MCU_(D6)  (via drill 0.3)
  Top 0.152: v21.75,5.75 21.75,5.94 21.94,5.94 22.19,6.19 23.5,6.19 23.56,6.12 25.81,6.12 27.94,8.25 27.94,13.31 24.44,13.31 23.5,14.25 v23.5,15
  Bottom 0.152: v21.75,5.75 MCU.10 | v23.5,15 23.25,15 23.12,15.12 23.12,17.31 24,18.19 24,21.88 23.06,22.81 21.62,22.81 X2.11
MCU_(D7)  (via drill 0.3)
  Top 0.152: v21.25,4.31 21.25,4.12 17.75,4.12 17.62,4.25 16.25,4.25 v16.06,4.44 | v17.06,17.56 17.12,17.62 18.75,17.62 18.81,17.69 22.06,17.69 22.12,17.62 24.12,17.62 v24.31,17.81
  Bottom 0.152: v21.25,4.31 MCU.11 | v16.06,4.44 16.25,4.44 16.25,12.19 16.88,12.81 16.88,17.38 v17.06,17.56 | v24.31,17.81 24.31,22 22.69,23.62 21.62,23.62 X2.13
MCU_(D8)  (via drill 0.3)
  Top 0.152: v24.62,13.81 24.62,13.62 27.56,13.62 27.94,14 27.94,18.12 27.62,18.12 27.44,18.31 27.44,23.88 26.75,23.88 26.56,24.06 23.12,24.06 v23,24.19
  Bottom 0.152: MCU.12 20.75,4.12 21.56,3.31 22.94,3.31 22.94,5.12 24.44,6.62 24.44,13.62 v24.62,13.81 | v23,24.19 22.81,24.38 21.62,24.38 X2.15
MCU_(D9)  (via drill 0.3)
  Top 0.152: v20.25,5.75 21,6.5 22.94,6.5 23.75,7.31 v25.44,7.31 | v25.44,14.31 25.44,16.5 26.75,16.5 27.12,16.88 27.12,19.75 24.94,19.75 24,20.69 24,20.94 | 24,20.94 24,22 SJ1.1 | v23,24.88 23.5,24.38 v26.94,24.38 | 24,20.94 v26.94,20.94
  Bottom 0.152: v20.25,5.75 MCU.13 | v25.44,14.31 v25.44,7.31 | v23,24.88 23,25.19 21.62,25.19 X2.17 | v26.94,24.38 26.75,24.38 26.75,21.12 v26.94,20.94
MCU_(D10)  (via drill 0.3)
  Top 0.152: v19.75,3.31 19.75,3.5 17.5,3.5 17.38,3.62 6.19,3.62 6.06,3.5 v5.38,3.5 | v8.44,17 v5.38,17 | v8.62,18.56 9.5,19.44 13.81,19.44 v14.06,19.69 | v14.12,24.88 14.12,24.69 22,24.69 v23,25.69 | v23,27.25 23.12,27.12 26,27.12 26,26 SJ2.1
  Bottom 0.152: v19.75,3.31 MCU.14 | v5.38,3.5 5.38,4.19 5.56,4.38 5.56,16.81 v5.38,17 | v8.44,17 8.62,17 v8.62,18.56 | v14.06,19.69 14.19,19.81 14.19,22.38 14.12,22.44 v14.12,24.88 | X2.19 22.69,26 v23,25.69 v23,27.25
MCU_RXD<--TXD  (via drill 0.3)
  Top 0.152: v21.94,15.25 14.44,15.25 14.31,15.38 12.81,15.38 12.75,15.44 11.25,15.44 v10.88,15.81
  Bottom 0.152: MCU.31 21.75,11.81 21.94,12 v21.94,15.25 | v10.88,15.81 10.69,15.81 10.5,16 IC2.9
MCU_RXD<--TXD_USB  (via drill 0.3)
  Top 0.152: v7.12,16.5 5,16.5 3.69,17.81 1,17.81 SW1.4
  Bottom 0.152: IC2.7 9.31,15 9.12,15.19 8.75,15.19 8.75,15.31 8.56,15.5 7.44,15.5 7.12,15.81 v7.12,16.5
MCU_TXD-->RXD  (via drill 0.3)
  Top 0.152: v15.5,13.5 v21.25,13.5
  Bottom 0.152: v21.25,13.5 MCU.30 | v15.5,13.5 15.5,14.19 15.31,14.38 15.31,14.81 14.62,15.5 IC2.3
MCU_TXD-->RXD_USB  (via drill 0.3)
  Top 0.152: v13.12,15.94 11.38,17.69 9.19,17.69 9.12,17.75 8.31,17.75 8.25,17.81 6.06,17.81 SW1.1
  Bottom 0.152: IC2.5 13.25,14.5 13.25,14.75 13.12,14.88 v13.12,15.94
MISO  (via drill 0.3)
  Top 0.152: v18.75,5.75 18.5,6 14.12,6 13.94,6.19 8.06,6.19 v7.88,6 | v23.94,35.38 19.19,35.38 18.88,35.06 v18.56,35.06 | v15.75,31.31 v18.38,31.31 | v15.44,28 15.44,27.81 15.25,27.81 13.44,26 13.38,26 13,25.62 13,23.25 13.56,23.25 14.25,22.56 16.88,22.56 v17.06,22.75 18.06,22.75 18.06,20.5 17.75,20.19 16.62,20.19 16.44,20.38 16.06,20.38 15.94,20.25 v6.25,20.25
  Bottom 0.152: v18.75,5.75 MCU.16 | v7.88,6 6.19,6 6.19,20.25 | 6.19,20.25 6.19,20.56 6.12,20.62 5.25,20.62 USD.P$7 | WMOD.6 23.69,44 23.69,41.38 23.88,41.19 23.88,40.56 23.81,40.5 23.81,39.62 23.75,39.56 23.75,35.56 v23.94,35.38 | v18.56,35.06 18.38,34.88 v18.38,31.31 | v15.75,31.31 15.75,28.31 v15.44,28 | v17.06,22.75 17.06,22.06 17.94,21.19 19,21.19 X2.8 | v6.25,20.25 6.19,20.25
MOSI  (via drill 0.3)
  Top 0.152: v19.25,4.94 15.56,4.94 14.56,3.94 5.94,3.94 v5.88,4 | v5.69,18.75 6.19,19.25 v7.44,19.25 | v17.56,20.69 17.31,20.69 16.38,21.62 v7.44,21.62 7.44,21.69 7.25,21.88 5.19,21.88 4.81,22.25 3.88,22.25 v3.81,22.31 | v23.38,41 23.38,36.25 23.12,36 18.94,36 18.81,35.88 17.38,35.88 16.62,35.12 9.44,35.12 9,35.56 7.19,35.56 v7.12,35.5
  Bottom 0.152: v19.25,4.94 MCU.15 | v5.88,4 5.88,18.56 v5.69,18.75 | v7.44,21.62 v7.44,19.25 | v17.56,20.69 17.88,20.38 19,20.38 X2.6 | v3.81,22.31 3.81,23.56 4,23.75 4,24.25 4.06,24.31 4.06,25 5.19,25 USD.P$3 5.25,25 6.31,25 7.56,26.25 7.56,27.88 7.88,28.19 7.88,29.62 7.12,30.38 v7.12,35.5 | WMOD.7 23.38,42 v23.38,41
N$1  (via drill 0.3)
  Top 0.152: v25.06,34.94 25,34.88 v21.81,34.88 | v21.81,30.88 21.81,30.69 v23.81,30.69 | v24,24.94 24.88,24.94 25,25.06 SJ2.2
  Bottom 0.152: v25.06,34.94 25.12,34.94 25.56,34.5 25.56,34.12 26.5,34.12 R9.2 | v21.81,30.88 v21.81,34.88 | v23.81,30.69 23.88,30.62 23.88,29.94 24.06,29.75 24.06,29.31 24.19,29.19 24.19,25.12 v24,24.94
N$6  (via drill 0.3)
  Top 0.152: v15.44,11.31 v14.31,11.31
  Bottom 0.152: 10.25,6.19 IC1.16 | 10.25,6.19 9,4.94 9,2.44 8.94,2.38 8,2.38 C1.1 | v14.31,11.31 14.31,10.75 IC1.1 | v15.44,11.31 15.62,11.31 15.62,5.12 15.38,4.88 10.25,4.88 10.25,6.19
N$9  (via drill 0.3)
  Top 0.152: v10,30.44 10,28.25 6.5,28.25 6.31,28.44 4.44,28.44 2.06,26.06 2.06,25.56 | 2.06,25.56 1,25.56 SW2.6 | v2.62,21.31 2,21.31 1.75,21.06 1,21.06 SW2.8 | 2.06,25.56 v3.62,25.56
  Bottom 0.152: v10,30.44 R6.2 | v2.62,21.31 2.81,21.5 2.81,22 3.5,22.69 3.5,23.69 3.62,23.81 v3.62,25.56
N$11
  Bottom 0.152: MCU.20 16.56,8.75 16.56,2.88 17.06,2.38 18,2.38 C2.1
N$12  (via drill 0.3)
  Top 0.152: v11.69,29.81 11.69,28.44 11.94,28.44 12.25,28.12 12.25,27.44 11.56,27.44 11.38,27.62 7.5,27.62 6.94,27.06 6.06,27.06 SW2.1 6.06,27 6.06,25.56 SW2.2
  Bottom 0.152: v11.69,29.81 11.69,32.88 12,32.88 R3.2
N$14  (via drill 0.3)
  Top 0.152: v15.62,32.06 15.62,32.56 13.31,32.56 13.12,32.38 2.69,32.38 2.5,32.19 v1.06,32.19 | v2.19,20.81 4.69,20.81 4.94,21.06 6,21.06 SW2.4
  Bottom 0.152: v15.62,32.06 15.62,32.88 16,32.88 R4.2 | v1.06,32.19 0.88,32.19 0.88,26.19 2,25.06 2,21 v2.19,20.81
N$15  (via drill 0.3)
  Top 0.152: v13.5,32.06 2.81,32.06 1.56,30.81 1.56,27.06 1,27.06 SW2.5
  Bottom 0.152: v13.5,32.06 13.5,32.88 14,32.88 R5.2
RESET  (via drill 0.3)
  Top 0.152: v8.38,12.19 8.56,12.38 v20.75,12.38 | v5.12,34.31 2.38,34.31 S1.1 2.38,34.38 2.38,34.94 1.94,34.94 v1.69,35.19 | S1.2 2.38,30.19 v5.12,30.19 5.12,30.25 6.31,31.44 10.94,31.44 11.62,30.75 13.12,30.75 14.81,29.06 15.06,29.06 15.94,28.19 15.94,27.81 15.62,27.5 15.38,27.5 13.56,25.69 13.5,25.69 13.31,25.5 13.31,24.44 14.44,23.31 14.81,23.31 v14.94,23.19 | v23.38,53 23.31,52.94 4.5,52.94 4.19,52.62 4.19,52.06 4.62,51.62 5.31,51.62 5.5,51.44 5.5,46 WMOD_OPZ.5
  Bottom 0.152: IC1.18 9.25,7.75 9.06,7.56 8.62,7.56 8.44,7.75 8.44,10.69 8.38,10.75 v8.38,12.19 | MCU.29 v20.75,12.38 20.75,17.38 18.56,17.38 17.56,18.38 17.56,19.62 | 17.56,19.62 19,19.62 X2.4 | 5.12,32.88 6,32.88 R1.1 | v5.12,34.31 5.12,32.88 | 5.12,32.88 v5.12,30.19 | WMOD.1 23.38,54 v23.38,53 | v1.69,35.19 1.5,35.19 1.5,40.56 1.88,40.94 1.88,45.69 2.12,45.94 3.12,45.94 3.12,46 WMOD_OPZ.5 | 17.56,19.62 17.19,19.62 16.44,20.38 14.81,20.38 14.81,23.06 v14.94,23.19
RXD_USB  (via drill 0.3)
  Top 0.152: v14.31,13.94 14.31,14.94 14.19,15.06 12.69,15.06 12.62,15.12 7.56,15.12 7.12,15.56 2.81,15.56 2.06,14.81 1,14.81 SW1.5
  Bottom 0.152: IC1.2 14.69,10.25 14.69,10.31 14.94,10.56 14.94,10.94 14.88,11 14.88,13.38 v14.31,13.94
SCK  (via drill 0.3)
  Top 0.152: v17.25,7.31 16.75,7.81 16.75,9.44 14.94,9.44 14.88,9.38 14.81,9.38 14.75,9.44 v1.44,9.44 | 2.81,24.19 3.94,24.19 4,24.25 v6.62,24.25 | 2.81,24.19 v1.19,24.19 | v23.38,45 23.38,41.62 24.12,41.62 24.81,40.94 25.5,40.94 26.19,40.25 26.19,35.06 25.88,35.06 25.12,34.31 20.88,34.31 20.62,34.06 16.75,34.06 16.19,33.5 12.94,33.5 12.75,33.31 9.56,33.31 9.19,33.69 3.5,33.69 3.25,33.44 v1.88,33.44 | 2.81,24.19 v2.81,24.38 | v17.56,22.25 7.81,22.25 7.69,22.38 v7.19,22.38
  Bottom 0.152: MCU.17 17.25,7.25 v17.25,7.31 | v1.44,9.44 1.44,19.69 1.38,19.75 1.38,24 v1.19,24.19 | 6.62,23.19 v6.62,24.25 | 6.62,23.19 6.19,22.75 5.25,22.75 USD.P$5 | WMOD.5 23.38,46 v23.38,45 | v1.88,33.44 1.88,31.75 1.5,31.38 1.5,26.44 2.62,25.31 2.62,24.56 v2.81,24.38 | X2.10 17.56,22 v17.56,22.25 | v7.19,22.38 6.69,22.88 6.69,23.19 6.62,23.19
SCL  (via drill 0.3)
  Top 0.152: v20.25,16.19 23.44,16.19 v23.62,16.38 | v4.19,53.94 4.88,53.94 5.56,53.25 22.94,53.25 23.19,53.5 v24.06,53.5 | v17.56,23.88 17.56,24.06 22,24.06 22.69,23.38 24.31,23.38 v24.44,23.25 | v25.94,30.12 v24.38,30.12
  Bottom 0.152: MCU.28 20.25,11.81 20.06,12 20.06,16 v20.25,16.19 | v23.62,16.38 23.88,16.12 24.5,16.12 R8.1 24.56,16.12 25.25,16.12 25.31,16.19 25.31,16.88 26.12,17.69 26.12,30.12 | WMOD.20 4.19,50 v4.19,53.94 | v24.06,53.5 24.25,53.5 24.81,52.94 25.5,52.94 26.94,51.5 26.94,48.56 27.31,48.19 27.31,31.62 26.12,30.44 26.12,30.12 | v17.56,23.88 17.56,23.62 19,23.62 X2.14 | v24.44,23.25 24.5,23.31 24.5,29.31 24.38,29.44 v24.38,30.12 | 26.12,30.12 v25.94,30.12
SDA  (via drill 0.3)
  Top 0.152: v26.56,17 21.88,17 21.81,17.06 19.75,17.06 v19.75,16.88 19.75,16.81 19.56,16.62 15,16.62 v14.56,17.06 | v3.12,32.88 v1.06,32.88 | v3.12,31.56 3.12,31.75 11.06,31.75 11.75,31.06 13.25,31.06 14.94,29.38 15.19,29.38 16.25,28.31 16.25,27.81 v16.5,27.81 | v16.88,23.81 v14.62,23.81
  Bottom 0.152: v19.75,16.88 MCU.27 | v26.56,17 26.56,16.12 26.5,16.12 R7.1 | WMOD.19 4.19,48 4.19,47.75 3.38,46.94 2.69,46.94 1.56,45.81 1.56,42 0.88,41.31 0.88,33.06 v1.06,32.88 | v3.12,31.56 v3.12,32.88 | v16.5,27.81 16.75,27.81 16.75,26.5 17.06,26.19 17.06,23.81 | 17.06,23.81 17.06,23.69 17.94,22.81 19,22.81 X2.12 | v14.56,17.06 14.56,19.88 14.5,19.94 14.5,22.5 14.44,22.56 14.44,23.62 v14.62,23.81 | 17.06,23.81 v16.88,23.81
TXD_USB  (via drill 0.3)
  Top 0.152: v12.75,14.56 12.75,14.75 12.56,14.75 12.5,14.81 6.06,14.81 SW1.2
  Bottom 0.152: v12.75,14.56 IC1.30
UART_CTRL  (via drill 0.3)
  Top 0.152: v19.25,14 19.25,13.81 15.88,13.81 15.69,14 v15,14 15,13.94 14.5,13.44 v11.25,13.44
  Bottom 0.152: v19.25,14 MCU.26 | v15,14 15,14.62 14.62,15 IC2.4 | IC2.8 10.5,15.5 11.06,14.94 11.06,13.62 v11.25,13.44
VBUS  (via drill 0.3)
  Top 0.152: v8.94,8.12 6.38,8.12 X1.1
  Bottom 0.152: IC1.19 8.94,8.25 v8.94,8.12
VCC33  (via drill 0.3)
  Top 0.203: v23.94,8 v17.31,8 | 7.19,23.38 v6.12,23.38 | 7.19,23.38 7.94,22.62 13.25,22.62 v13.38,22.75 | v13.44,18.12 14,18.12 | 14,18.12 v18.56,18.12 | v23.62,15.69 23.5,15.81 20.62,15.81 20.44,15.62 15.25,15.62 14,16.88 14,18.12 | v1.06,45.31 1.06,45.19 0.69,45.19 0.31,44.81 0.31,39.19 2.12,39.19 2.19,39.12 2.56,39.12 2.69,39 3.5,39 3.62,38.88 v5.56,38.88 6.06,38.38 22.25,38.38 v22.25,38.5 | v8.12,23.44 7.25,23.44 7.19,23.38
  Bottom 0.203: 26,14.81 26,14.12 25.81,13.94 25.81,9.62 26.5,9.62 C4.1 | 26,14.81 26.06,14.88 26.5,14.88 R7.2 | MCU.18 17.56,7.75 v17.31,8 | 24.06,9.25 24.06,14.81 24.12,14.88 24.5,14.88 R8.2 | 24.06,9.25 24.06,8 v23.94,8 24,8.25 MCU.6 | 24.06,9.25 MCU.4 | 26,14.81 25.94,14.88 24.56,14.88 R8.2 | X2.1 21.56,18.81 19.06,18.81 X2.2 18.94,18.81 18.56,18.81 v18.56,18.12 | 13.38,17.12 13.5,17.12 13.5,16.56 13.56,16.5 IC2.1 | 13.38,17.12 9.44,17.12 9,16.69 9,16.12 8,16.12 C5.1 | v6.12,23.38 6.12,23.88 5.25,23.88 USD.P$4 | 13.38,17.12 13.38,18.12 | 13.38,18.12 v13.38,22.75 | v13.44,18.12 13.38,18.12 | v23.62,15.69 24.06,15.25 24.06,14.94 R8.2 | R9.1 26.5,32.88 24.5,32.88 C3.1 24.44,32.88 23.38,32.88 23.38,39.75 23.12,40 WMOD.8 22.25,39.94 v22.25,38.5 | v1.06,45.31 0.94,45.44 0.94,49.31 1.31,49.69 1.31,51.62 3.12,53.44 3.12,54 WMOD_OPZ.1 | v5.56,38.88 5.69,38.88 5.69,36.31 5.56,36.19 5.56,34.62 5.69,34.5 5.69,34.19 5.75,34.12 5.94,34.12 R1.2 6,34.12 6.56,34.12 6.56,35.69 6.94,36.06 9.19,36.06 9.19,34.19 9.25,34.12 10,34.12 R6.1 10.06,34.12 12,34.12 R3.1 12.06,34.12 12.88,34.12 12.94,34.06 12.94,30.31 11.69,29.06 11.69,28.5 9.12,28.5 8.25,27.62 8.25,23.56 v8.12,23.44
WMOD_(A0)  (via drill 0.3)
  Top 0.152: v26.81,34.94 26.62,34.75 26,34.75 25.25,34 21,34 20.44,33.44 18,33.44 17.81,33.25 v17.56,33.25
  Bottom 0.152: WMOD.2 24,52 24,51.75 24.69,51.06 26.62,51.06 26.62,48.44 27,48.06 27,35.12 v26.81,34.94 | v17.56,33.25 17.56,28.75 17.94,28.38 19,28.38 X2.26
WMOD_(D2)  (via drill 0.3)
  Top 0.152: v4.31,32.88 4.31,32.69 13,32.69 13.19,32.88 v17,32.88
  Bottom 0.152: WMOD.17 4.69,44 4.69,42.12 4.31,41.75 v4.31,32.88 | v17,32.88 17.25,32.88 17.25,28.5 17.06,28.31 17.06,26.62 17.69,26 X2.20
WMOD_(D15)  (via drill 0.3)
  Top 0.152: v4.81,34.94 v7.62,34.94 7.62,34.88 8,34.5 14.94,34.5 v15.12,34.31 | v17.56,26.81 17.06,26.81 | 17.06,26.81 15.12,26.81 13.69,25.38 13.62,25.38 13.62,24.69 13.94,24.38 22.12,24.38 22.81,23.69 23.19,23.69 23.25,23.75 26,23.75 26,22 SJ1.3 | v15.12,29.88 15.12,29.69 15.31,29.69 17.06,27.94 17.06,26.81
  Bottom 0.152: v7.62,34.94 7.62,34.12 8,34.12 R2.1 | v4.81,34.94 4.62,34.94 4.62,41.62 5,42 WMOD.16 | v17.56,26.81 19,26.81 X2.22 | v15.12,29.88 v15.12,34.31
WMOD_(D16)  (via drill 0.3)
  Top 0.152: 22.5,26.75 18.31,26.75 v17.56,27.5 | 22.5,26.75 24,26.75 24,26 SJ2.3 | v23.5,48.88 24.62,48.88 24.69,48.94 25.5,48.94 25.56,48.88 v27.75,48.88 | v27.25,28.62 26.88,28.25 23.38,28.25 23.19,28.44 22.81,28.44 22.5,28.12 22.5,26.75
  Bottom 0.152: v17.56,27.5 18.25,27.5 18.25,27.56 18.31,27.62 19,27.62 X2.24 | WMOD.4 23.5,48 v23.5,48.88 | v27.75,48.88 27.94,48.88 27.94,30.19 27.44,29.69 27.44,28.81 v27.25,28.62
WMOD_ENABLE  (via drill 0.3)
  Top 0.152: v9,30.94 11,30.94 11.5,30.44 12.56,30.44 12.56,27.31 12.38,27.12 11.44,27.12 11.25,27.31 7.62,27.31 7.19,26.88 7.19,24.12 6.81,23.75 6.44,23.75 6.25,23.94 4.12,23.94 4.06,23.88 2.88,23.88 1.56,22.56 1,22.56 SW2.7 | v9,33.19 9,33 12.88,33 13.06,33.19 16.31,33.19 16.69,33.56 v16.94,33.56 | v17.5,35.31 17.5,35.56 18.94,35.56 19.06,35.69 23.25,35.69 v24.25,36.69
  Bottom 0.152: v9,33.19 v9,30.94 | v16.94,33.56 17.19,33.81 17.19,34.31 17.5,34.62 v17.5,35.31 | v24.25,36.69 24.25,37.5 24.12,37.62 24.12,38.38 24.19,38.44 24.19,39.56 24.12,39.62 24.12,40.38 24.19,40.44 24.19,41.31 24,41.5 24,49.12 23.12,50 WMOD.3
WMOD_MODE  (via drill 0.3)
  Top 0.152: v2.5,22.81 4,22.81 4.25,22.56 6,22.56 SW2.3 | v1.38,41.12 2.62,41.12 2.69,41.06 3.5,41.06 4.19,41.75 v4.19,42.31
  Bottom 0.152: v2.5,22.81 2.31,22.81 2.31,25.19 1.19,26.31 1.19,31.5 1.56,31.88 1.56,33.06 1.19,33.44 1.19,40.94 v1.38,41.12 | v4.19,42.31 4.38,42.31 4.38,45.19 5.19,46 WMOD.18
WMOD_RXD<--TXD_USB  (via drill 0.3)
  Top 0.152: v2.19,13.31 1,13.31 SW1.6 | v0.94,53.12 2.62,53.12 2.69,53.06 3.5,53.06 3.56,53.12 4.25,53.12 4.56,53.44 v4.69,53.44
  Bottom 0.152: v2.19,13.31 1.75,13.31 1.75,19.81 1.69,19.88 1.69,24.94 0.56,26.06 0.56,49.44 0.94,49.81 v0.94,53.12 | v4.69,53.44 5.25,54 WMOD.22
WMOD_TXD-->RXD_USB  (via drill 0.3)
  Top 0.152: v8.88,13.31 6.06,13.31 SW1.3 | v8.88,11.75 8.88,12.06 20.38,12.06 20.56,11.88 v27.12,11.88 | v27.25,52.88 25.56,52.88 25.5,52.94 24.69,52.94 24.62,52.88 23.94,52.88 23.56,52.5 23.19,52.5 23.06,52.62 4.88,52.62 v4.69,52.44
  Bottom 0.152: v8.88,11.75 v8.88,13.31 | v27.12,11.88 27.31,11.88 27.31,15.25 27.06,15.5 25.94,15.5 25.62,15.81 25.62,16.75 26.44,17.56 26.44,30.31 27.62,31.5 27.62,48.31 27.25,48.69 v27.25,52.88 | v4.69,52.44 5.12,52 WMOD.21
X1  (via drill 0.3)
  Top 0.152: v25.62,6.62 v23.75,6.62
  Bottom 0.152: C6.1 25.62,4 25.62,3.88 XTAL1.P$1 25.62,4.06 v25.62,6.62 | MCU.7 23.31,7.75 23.75,7.31 v23.75,6.62
X2  (via drill 0.3)
  Top 0.152: v22.81,5.69 22.81,4.94 v23.44,4.94
  Bottom 0.152: C7.1 26.56,2 26.56,1.56 26.12,1.12 24.38,1.12 24.38,2.12 XTAL1.P$3 24.38,2.19 24.38,2.81 23.88,2.81 23.44,3.25 v23.44,4.94 | MCU.8 22.81,7.25 v22.81,5.69
ZB/SX_CTRL  (via drill 0.3)
  Top 0.152: v18.19,11.56 26.75,11.56 27.06,11.25 v27.44,11.25 | v25.12,20.25 v26.94,20.25 | WMOD_OPZ.9 v22.81,38
  Bottom 0.152: v18.19,11.56 18.19,11.44 18.75,11.44 MCU.25 | v27.44,11.25 27.62,11.25 27.62,16.88 27.12,17.38 27.12,20.06 v26.94,20.25 | v25.12,20.25 24.94,20.25 24.94,23.44 24.81,23.56 24.81,28.81 25.44,29.44 25.44,30.31 23,32.75 23,37.81 v22.81,38
ZB/SX_RXD<--TXD  (via drill 0.3)
  Top 0.152: v11.75,12.88 11.75,12.69 7.31,12.69 7.12,12.5 v0.44,12.5 | WMOD_OPZ.3 v0.44,50
  Bottom 0.152: IC2.10 11.06,16.5 11.38,16.19 11.38,14 11.75,13.62 v11.75,12.88 | v0.44,12.5 0.25,12.5 0.25,49.81 v0.44,50
ZB/SX_TXD-->RXD  (via drill 0.3)
  Top 0.152: v15.06,18.69 15,18.62 12,18.62 11.38,18 9.31,18 9.25,18.06 8.44,18.06 7.94,18.56 7.94,19.75 v0.75,19.75 | v0.75,24.75 2.5,24.75 2.75,25 v3.12,25 | v2,40.38 1.75,40.62 1.19,40.62 0.69,41.12 0.69,44.69 0.81,44.81 1.25,44.81 2,45.56 2,46.38 2.12,46.38 2.81,47.06 3.5,47.06 3.56,47.12 4.94,47.12 5.19,47.38 5.19,51.31 4.5,51.31 3.81,52 WMOD_OPZ.2
  Bottom 0.152: IC2.2 15.06,16 v15.06,18.69 | v0.75,19.75 0.56,19.75 0.56,24.56 v0.75,24.75 | v3.12,25 2.94,25 2.94,25.44 1.81,26.56 1.81,31.25 2.19,31.62 2.19,33.06 2.38,33.25 2.38,35.19 1.81,35.75 1.81,40.19 v2,40.38

### Text on the board
tNames: Smart ezNODE 503 / M1 (core) HW 1.0 Rev. 0